# EAGLE design SigfoxTracker (EAGLE 9.6.2)
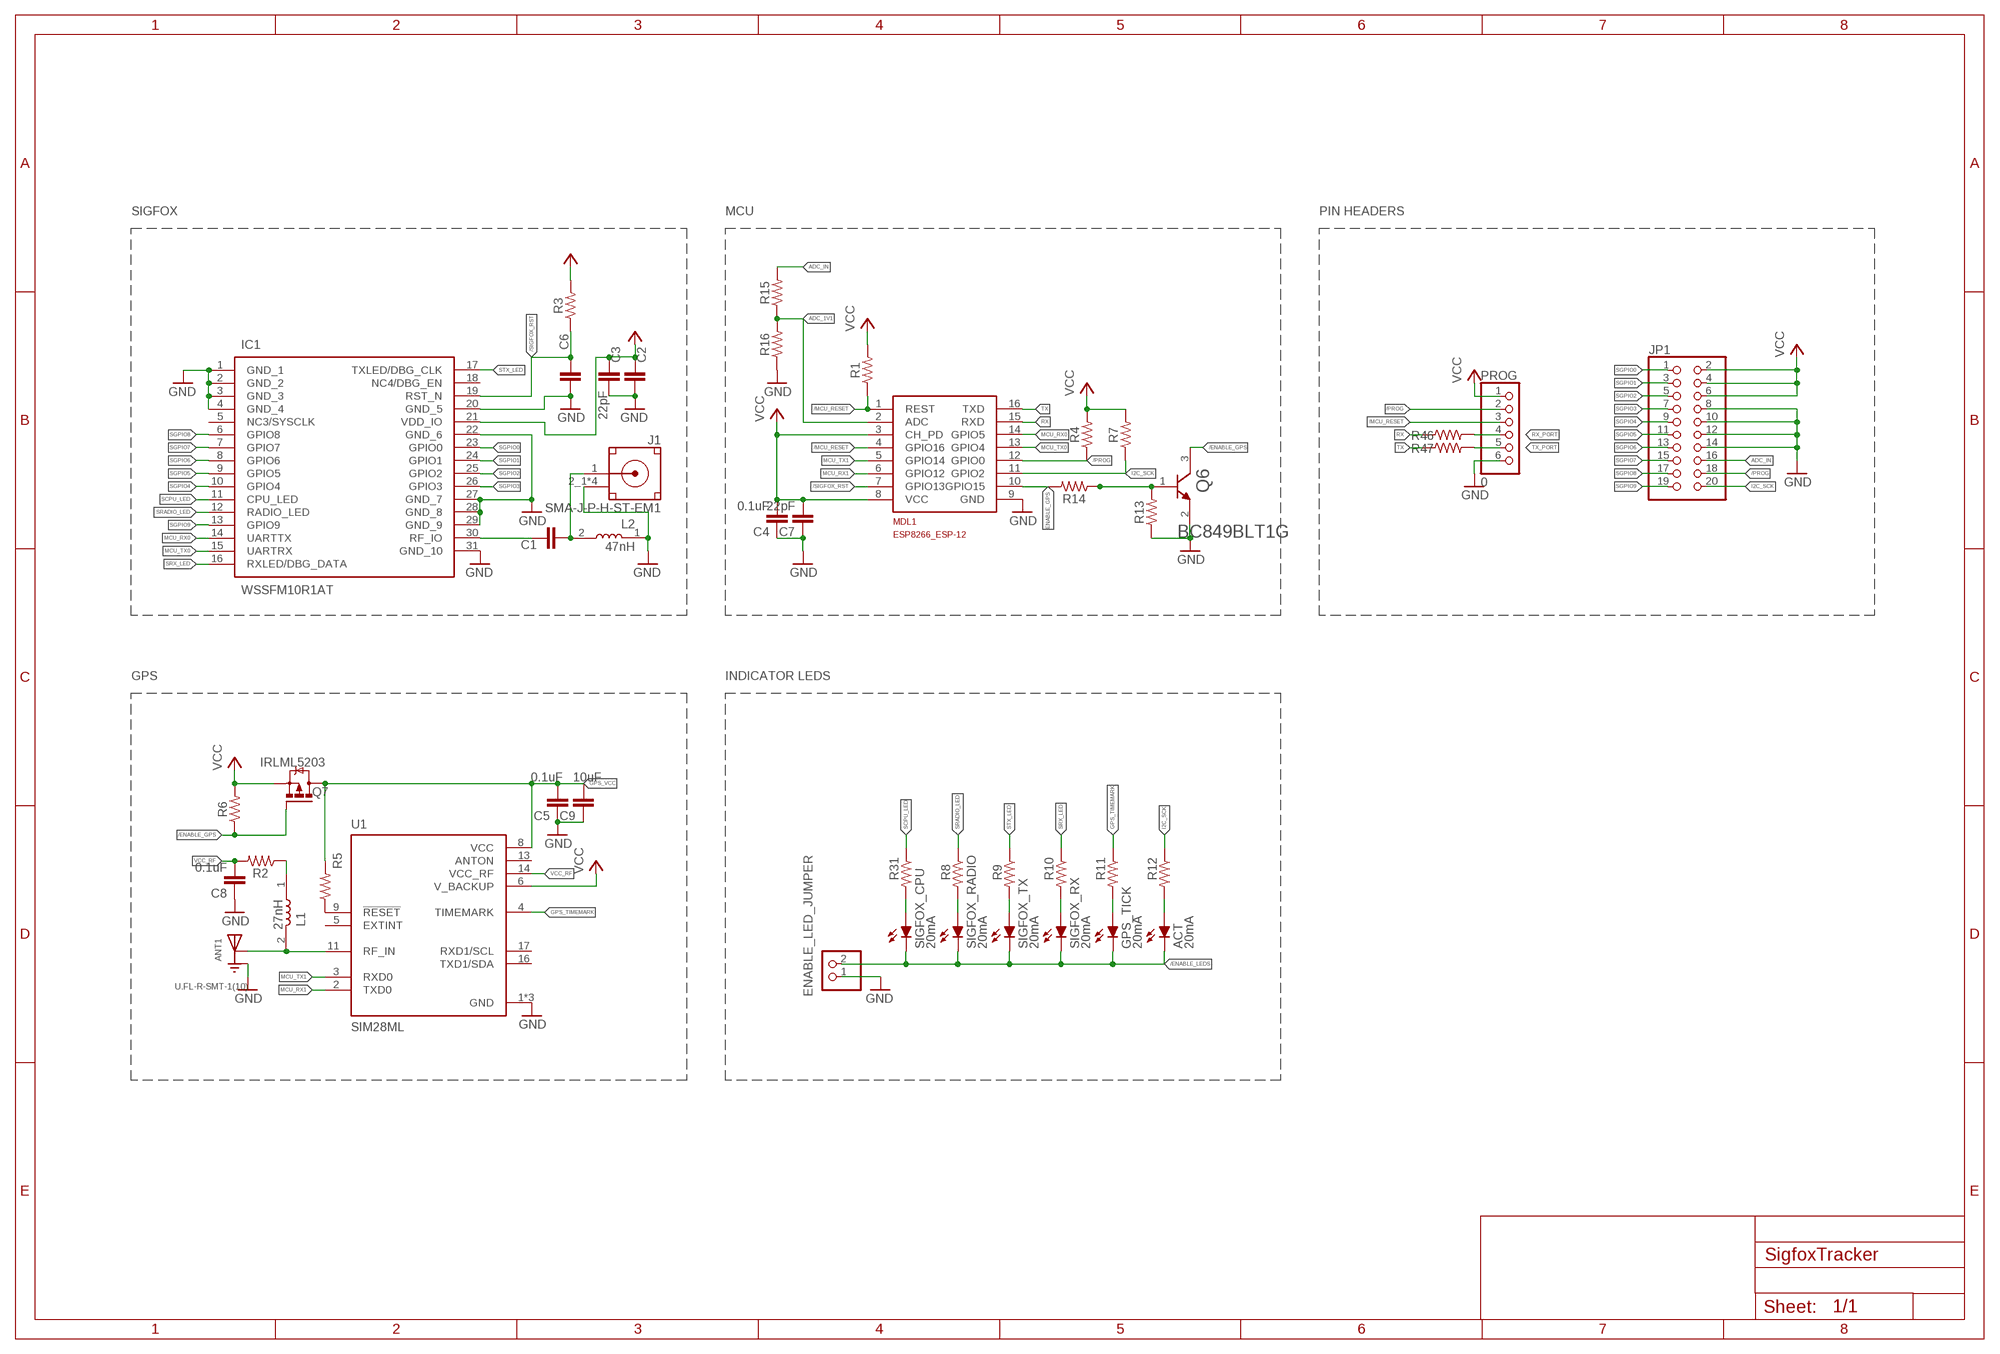
[diagram p0: schematic, sheet 1]

## Parts
ACT  20mA  LED_LEDCHIP-LED0603MP  [LED_CHIP-LED0603MP]
ANT1  U.FL-R-SMT-1(10)  [HRS_U.FL-R-SMT-1(10)]
C1  100pF  C-EUC0603  [C0603]
C2  0.1uF  C-EUC0603  [C0603]
C3  22pF  C-EUC0603  [C0603]
C4  0.1uF  C-EUC0603  [C0603]
C5  0.1uF  C-EUC0603  [C0603]
C6  0.1uF  C-EUC0603  [C0603]
C7  22pF  C-EUC0603  [C0603]
C8  0.1uF  C-EUC0603  [C0603]
C9  10uF  C-EUC0603  [C0603]
ENABLE_LED_JUMPER  PINHD-1X2  [1X02]
GPS_TICK  20mA  LED_LEDCHIP-LED0603MP  [LED_CHIP-LED0603MP]
IC1  WSSFM10R1AT  [WSSFM10R1AT]
J1  SMA-J-P-H-ST-EM1  [SMA-J-P-H-ST-EM1]
JP1  PINHD-2X10  [2X10]
L1  27nH  LQG15HN27NJ02D  [INDC1005X45]
L2  47nH  LQG15HN27NJ02D  [INDC1005X45]
MDL1  MCU  ESP8266-12GPIO04/05_CORRECTED  [ESP8266-ESP12]
PROG  0  PINHD-1X6  [1X06]
Q6  ON_SEMICONDUCTOR_BC849BLT1GON_SEMICONDUCTOR_BC849BLT1G_0_0  [ON_SEMICONDUCTOR_BC849BLT1G_0]
Q7  IRLML5203  [MICRO3]
R1  100k  52101-101-REV-A_RC-MASTER-SMD_R_0603MP  [52101-101-REV-A_RC-MASTER-SMD_R0603MP]
R2  10R  RC-MASTER-SMD_R_0603MP  [RC-MASTER-SMD_R0603MP]
R3  100K  RC-MASTER-SMD_R_0603MP  [RC-MASTER-SMD_R0603MP]
R4  4K7  52101-101-REV-A_RC-MASTER-SMD_R_0603MP  [52101-101-REV-A_RC-MASTER-SMD_R0603MP]
R5  100k  52101-101-REV-A_RC-MASTER-SMD_R_0603MP  [52101-101-REV-A_RC-MASTER-SMD_R0603MP]
R6  100K  RC-MASTER-SMD_R_0603MP  [RC-MASTER-SMD_R0603MP]
R7  4K7  52101-101-REV-A_RC-MASTER-SMD_R_0603MP  [52101-101-REV-A_RC-MASTER-SMD_R0603MP]
R8  1K  52101-101-REV-A_RC-MASTER-SMD_R_0603MP  [52101-101-REV-A_RC-MASTER-SMD_R0603MP]
R9  1K  52101-101-REV-A_RC-MASTER-SMD_R_0603MP  [52101-101-REV-A_RC-MASTER-SMD_R0603MP]
R10  1K  52101-101-REV-A_RC-MASTER-SMD_R_0603MP  [52101-101-REV-A_RC-MASTER-SMD_R0603MP]
R11  1K  52101-101-REV-A_RC-MASTER-SMD_R_0603MP  [52101-101-REV-A_RC-MASTER-SMD_R0603MP]
R12  1K  52101-101-REV-A_RC-MASTER-SMD_R_0603MP  [52101-101-REV-A_RC-MASTER-SMD_R0603MP]
R13  100k  52101-101-REV-A_RC-MASTER-SMD_R_0603MP  [52101-101-REV-A_RC-MASTER-SMD_R0603MP]
R14  1K  52101-101-REV-A_RC-MASTER-SMD_R_0603MP  [52101-101-REV-A_RC-MASTER-SMD_R0603MP]
R15  10K  52101-101-REV-A_RC-MASTER-SMD_R_0603MP  [52101-101-REV-A_RC-MASTER-SMD_R0603MP]
R16  3V3  52101-101-REV-A_RC-MASTER-SMD_R_0603MP  [52101-101-REV-A_RC-MASTER-SMD_R0603MP]
R31  1K  52101-101-REV-A_RC-MASTER-SMD_R_0603MP  [52101-101-REV-A_RC-MASTER-SMD_R0603MP]
R46  20R  RC-MASTER-SMD_R_0603MP  [RC-MASTER-SMD_R0603MP]
R47  20R  RC-MASTER-SMD_R_0603MP  [RC-MASTER-SMD_R0603MP]
SIGFOX_CPU  20mA  LED_LEDCHIP-LED0603MP  [LED_CHIP-LED0603MP]
SIGFOX_RADIO  20mA  LED_LEDCHIP-LED0603MP  [LED_CHIP-LED0603MP]
SIGFOX_RX  20mA  LED_LEDCHIP-LED0603MP  [LED_CHIP-LED0603MP]
SIGFOX_TX  20mA  LED_LEDCHIP-LED0603MP  [LED_CHIP-LED0603MP]
U1  SIM28ML  [XCVR_SIM28ML]

## Nets
/ENABLE_GPS: Q6.3(C) Q7.1(G) R6.1
/ENABLE_LEDS: ACT.C ENABLE_LED_JUMPER.2 GPS_TICK.C SIGFOX_CPU.C SIGFOX_RADIO.C SIGFOX_RX.C SIGFOX_TX.C
/MCU_RESET: MDL1.1(REST) MDL1.4(GPIO16) PROG.3 R1.1
/PROG: JP1.18 MDL1.12(GPIO0) PROG.2 R4.1
/SIGFOX_RST: C6.1 IC1.19(RST_N) MDL1.7(GPIO13) R3.1
ADC_1V1: MDL1.2(ADC) R15.1 R16.2
ADC_IN: JP1.16 R15.2
ENABLE_GPS: MDL1.10(GPIO15) R14.2
GND: ANT1.1(GND) ANT1.3(GND) C2.1 C3.1 C4.1 C5.1 C6.2 C7.1 C8.1 C9.1 ENABLE_LED_JUMPER.1 IC1.1(GND_1) IC1.2(GND_2) IC1.3(GND_3) IC1.4(GND_4) IC1.20(GND_5) IC1.22(GND_6) IC1.27(GND_7) IC1.28(GND_8) IC1.29(GND_9) IC1.31(GND_10) J1.2_1(GND) J1.2_2(GND) J1.3_1(GND) J1.3_2(GND) JP1.8 JP1.10 JP1.12 JP1.14 L2.1 MDL1.9(GND) PROG.6 Q6.2(E) R13.1 R16.1 U1.1(GND) U1.10(GND) U1.12(GND)
GPS_TIMEMARK: R11.1 U1.4(TIMEMARK)
GPS_VCC: C5.2 C9.2 Q7.3(D) R5.2 U1.8(VCC)
I2C_SCK: JP1.20 MDL1.11(GPIO2) R7.1 R12.1
MCU_RX0: IC1.14(UARTTX) MDL1.14(GPIO5)
MCU_RX1: MDL1.6(GPIO12) U1.2(TXD0)
MCU_TX0: IC1.15(UARTRX) MDL1.13(GPIO4)
MCU_TX1: MDL1.5(GPIO14) U1.3(RXD0)
N$1: R5.1 U1.9(!RESET)
N$2: C1.2 J1.1(SIGNAL) L2.2
N$3: L1.1 R2.1
N$4: R8.2 SIGFOX_RADIO.A
N$5: R9.2 SIGFOX_TX.A
N$6: R10.2 SIGFOX_RX.A
N$7: GPS_TICK.A R11.2
N$8: ACT.A R12.2
N$9: R31.2 SIGFOX_CPU.A
N$10: Q6.1(B) R13.2 R14.1
RF_IN: ANT1.2(SIG) L1.2 U1.11(RF_IN)
RX: MDL1.15(RXD) R46.1
RX_PORT: PROG.4 R46.2
SCPU_LED: IC1.11(CPU_LED) R31.1
SGPIO0: IC1.23(GPIO0) JP1.1
SGPIO1: IC1.24(GPIO1) JP1.3
SGPIO2: IC1.25(GPIO2) JP1.5
SGPIO3: IC1.26(GPIO3) JP1.7
SGPIO4: IC1.10(GPIO4) JP1.9
SGPIO5: IC1.9(GPIO5) JP1.11
SGPIO6: IC1.8(GPIO6) JP1.13
SGPIO7: IC1.7(GPIO7) JP1.15
SGPIO8: IC1.6(GPIO8) JP1.17
SGPIO9: IC1.13(GPIO9) JP1.19
SIGFOX_RF_IO: C1.1 IC1.30(RF_IO)
SRADIO_LED: IC1.12(RADIO_LED) R8.1
SRX_LED: IC1.16(RXLED/DBG_DATA) R10.1
STX_LED: IC1.17(TXLED/DBG_CLK) R9.1
TX: MDL1.16(TXD) R47.1
TX_PORT: PROG.5 R47.2
VCC: C2.2 C3.2 C4.2 C7.2 IC1.21(VDD_IO) JP1.2 JP1.4 JP1.6 MDL1.3(CH_PD) MDL1.8(VCC) PROG.1 Q7.2(S) R1.2 R3.2 R4.2 R6.2 R7.2 U1.6(V_BACKUP)
VCC_RF: C8.2 R2.2 U1.14(VCC_RF)
Unconnected: IC1.5(NC3/SYSCLK) IC1.18(NC4/DBG_EN) U1.5(EXTINT) U1.16(TXD1/SDA) U1.17(RXD1/SCL)

## Notes on the sheet
- SIGFOX | MCU | PIN HEADERS
- GPS | INDICATOR LEDS

## Power pins joined to a net without a drawn wire
ANTON: U1.13(ANTON)

## Library data of the parts
ACT GPS_TICK SIGFOX_CPU SIGFOX_RADIO SIGFOX_RX SIGFOX_TX = 52101-101-REV-A:LED_LED: LED Various Types
ANT1 = U.FL-R-SMT-1_10_:U.FL-R-SMT-1(10): U.FL Series 6 Ghz 50 Ohm Ultra-small SMT Coaxial Cable Receptacle; AVAILABILITY: Unavailable; DESCRIPTION: U.FL Series 6 Ghz 50 Ohm Ultra-small SMT Coaxial Cable Receptacle; MF: Hirose; MP: U.FL-R-SMT-1_10_; PACKAGE: None; PRICE: None
C1-C9 = rcl:C-EU: CAPACITOR, European symbol; SPICEPREFIX: C
ENABLE_LED_JUMPER = pinhead:PINHD-1X2: PIN HEADER
IC1 = WSSFM10R1AT:WSSFM10R1AT: SIGFOX MODULE RCZ1 AT VERSION Source: Datasheet <http://www.erikrasmussen.dk/wisol_wssfm10r1at.pdf>; ARROW_PART_NUMBER: WSSFM10R1AT; DESCRIPTION: SIGFOX MODULE RCZ1 AT VERSION; HEIGHT: 2mm; MANUFACTURER_NAME: Wisol; MANUFACTURER_PART_NUMBER: WSSFM10R1AT
J1 = SMA-J-P-H-ST-EM1:SMA-J-P-H-ST-EM1: Connector SMA F 50Ohm Solder ST Edge Mount Gold Over Nickel Tray; AVAILABILITY: Unavailable; DESCRIPTION: Connector SMA F 50Ohm Solder ST Edge Mount Gold Over Nickel Tray; MF: Samtec; MP: SMA-J-P-H-ST-EM1; PACKAGE: None; PRICE: None
JP1 = pinhead:PINHD-2X10: PIN HEADER
L1 L2 = LQG15HN27NJ02D:LQG15HN27NJ02D: Ind RF Chip Multi-Layer 27nH 5% 100MHz 8Q-Factor Air 300mA 0402 Paper T/R; AVAILABILITY: Unavailable; DESCRIPTION: Inductor RF Chip Multi-Layer 27nH 5% 100MHz 8Q-Factor Air 300mA 670mOhm DCR 0402 T/R; MF: Murata; MP: LQG15HN27NJ02D; PACKAGE: 0402 Murata; PRICE: None
MDL1 = ESP8266-ESP12:ESP8266-12: Espressif ESP8266 ESP-12 Module with GPIO04 and GPIO05 corrected.
PROG = pinhead:PINHD-1X6: PIN HEADER
Q6 = On Semiconductor - BC849BLT1G:ON_SEMICONDUCTOR_BC849BLT1G: ONSC-NPN-B1E2C3-3; CIIVA_IDS: 19369299; COMPONENT_LINK_1_DESCRIPTION: Manufacturer URL; COMPONENT_LINK_1_URL: http://www.onsemi.com/; COMPONENT_LINK_3_DESCRIPTION: Package Specification; COMPONENT_LINK_3_URL: http://www.onsemi.cn/pub_link/Collateral/318-08.PDF; DATASHEET: http://www.onsemi.cn/pub_link/Collateral/BC846ALT1-D.PDF; DATASHEET_VERSION: Rev. 11; FOOTPRINT_VARIANT_NAME_0: Manufacturer Recommended; FT_MIN_MHZ: 100; IC_CONTINUOUS_A: 0.1; IMPORTED: yes; IMPORTED_FROM: vault; IMPORT_TS: 1521843736; MF: On Semiconductor; MOUNTING_TECHNOLOGY: Surface Mount; MPN: BC849BLT1G; PACKAGE: SOT-23-3-318-08; PACKAGE_DESCRIPTION: 3-Pin Small Outline Transistor, Body 2.92 x 1.3 mm, Pitch 0.95 mm; PACKAGE_VERSION: Rev. AP, 11/2009; PACKING: Tape and Reel; POLARITY: NPN; PREFIX: Q; RELEASE_DATE: 1406898388; ROHS: Yes; VAULT_GUID: 19D3C7D6-08FD-4A81-9BD4-62C7617130FB; VAULT_REVISION: B4675A61-FAF7-4072-9C56-0A9635A35669
Q7 = transistor-power:IRLML5203: HEXFET P-Channel Power MOSFET
R1 R4 R5 R7-R16 R31 = ESP32_DMX_Audio:52101-101-REV-A_RC-MASTER-SMD_R_: RESISTOR
R2 R3 R6 R46 R47 = 52101-101-REV-A:RC-MASTER-SMD_R_: RESISTOR
U1 = SIM28ML:SIM28ML: Module: GPS; ±2.5m; ±0, 1m/s; GPIO, PPS, UART; -165dBm; 2.8÷4.3VDC; AVAILABILITY: Unavailable; DESCRIPTION: Module: GPS; ±2.5m; ±0, 1m/s; GPIO, PPS, UART; -165dBm; 2.8÷4.3VDC; MF: Simcom; MP: SIM28ML; PACKAGE: None; PRICE: None

## Board
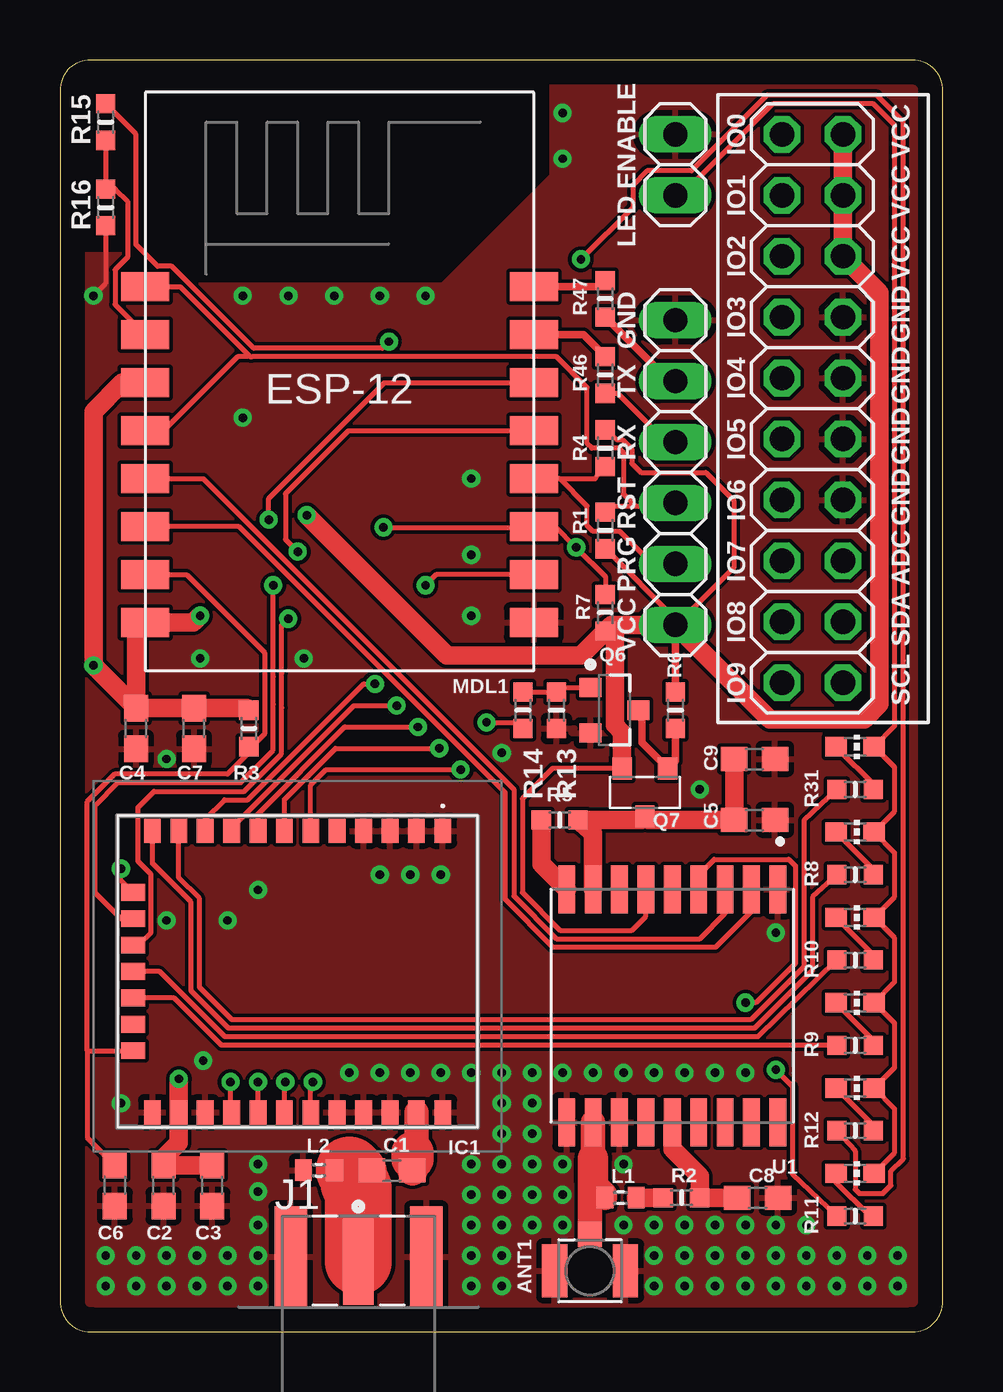
[diagram p1: board, top side]
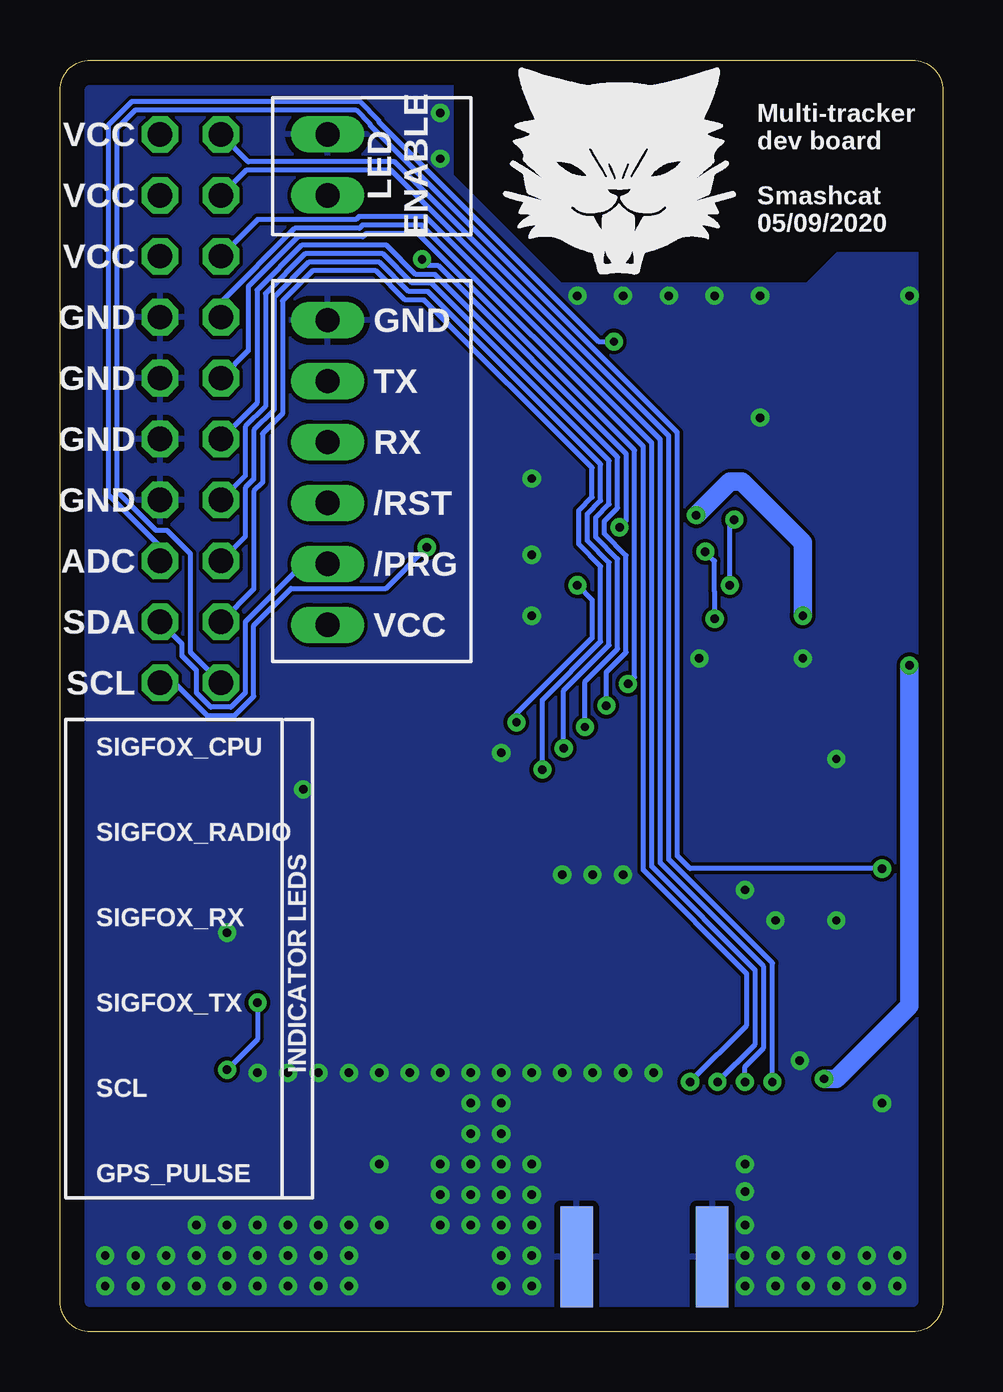
[diagram p2: board, bottom side, seen from below]

Size 36.81 x 53.01 mm. Coordinates in mm from the lower left corner, seen from the top.
Outline: 0,51.74 0,1.27 arc90 1.27,0 35.54,0 arc90 36.81,1.27 36.81,51.74 arc90 35.54,53.01 1.27,53.01 arc90 0,51.74
Copper layers (1*16): Top 0.035mm / dielectric 1.5mm / Bottom 0.035mm
Design rules "default": minimum track width 6mil, minimum drill 0.35mm, track to track 6mil, track to pad 6mil, pad to pad 6mil, via to via 6mil, smd to smd 6mil, copper to edge 40mil, drill to drill 6mil, minimum pad ring 10mil, minimum via ring 8mil, stop-mask expansion 4mil, vias tented up to drill 0mil, thermal gap 10mil

### Footprints (pad centres in the part's own frame; a part is rotated, then mirrored left to right if it is on the bottom)
LED_CHIP-LED0603MP = smd 0.8 x 0.9: A 0,-0.794; C 0,0.794
HRS_U.FL-R-SMT-1(10) = smd 1.05 x 2.2: 1 -1.475,0; 3 1.475,0 | smd 1 x 1.05: 2 0,-1.525
C0603 = smd 1.1 x 1: 1 -0.85,0; 2 0.85,0
1X02 = drill 1.016 long: 1 -1.27,0; 2 1.27,0
WSSFM10R1AT = smd 1 x 0.7: 1 -5.635,6.05; 2 -5.635,4.95; 3 -5.635,3.85; 4 -5.635,2.75; 5 -5.635,1.65; 6 -5.635,0.55; 7 -5.635,-0.55; 8 -5.635,-1.65; 9 -5.635,-2.75; 10 -5.635,-3.85; 11 -5.635,-4.95; 12 -5.635,-6.05; 20 6.085,-6.05; 21 6.085,-4.95; 22 6.085,-3.85; 23 6.085,-2.75; 24 6.085,-1.65; 25 6.085,-0.55; 26 6.085,0.55; 27 6.085,1.65; 28 6.085,2.75; 29 6.085,3.85; 30 6.085,4.95; 31 6.085,6.05 | smd 0.7 x 1: 13 -3.075,-6.86; 14 -1.975,-6.86; 15 -0.875,-6.86; 16 0.225,-6.86; 17 1.325,-6.86; 18 2.425,-6.86; 19 3.525,-6.86
SMA-J-P-H-ST-EM1 = smd 1.27 x 3.6: 1 0,0 | smd 1.35 x 4.2: 2_1 -2.825,0.2; 3_1 2.825,0.2 | smd 1.35 x 4.2 bottom: 2_2 -2.825,0.2; 3_2 2.825,0.2
2X10 = drill 1.016 octagon: 1 -11.43,-1.27; 2 -11.43,1.27; 3 -8.89,-1.27; 4 -8.89,1.27; 5 -6.35,-1.27; 6 -6.35,1.27; 7 -3.81,-1.27; 8 -3.81,1.27; 9 -1.27,-1.27; 10 -1.27,1.27; 11 1.27,-1.27; 12 1.27,1.27; 13 3.81,-1.27; 14 3.81,1.27; 15 6.35,-1.27; 16 6.35,1.27; 17 8.89,-1.27; 18 8.89,1.27; 19 11.43,-1.27; 20 11.43,1.27
INDC1005X45 = smd 0.7 x 0.9: 1 -0.65,0; 2 0.65,0
ESP8266-ESP12 = smd 2 x 1.2: 1 0,16; 2 0,14; 3 0,12; 4 0,10; 5 0,8; 6 0,6; 7 0,4; 8 0,2; 9 16.2,2; 10 16.2,4; 11 16.2,6; 12 16.2,8; 13 16.2,10; 14 16.2,12; 15 16.2,14; 16 16.2,16
1X06 = drill 1.016 long: 1 -6.35,0; 2 -3.81,0; 3 -1.27,0; 4 1.27,0; 5 3.81,0; 6 6.35,0
ON_SEMICONDUCTOR_BC849BLT1G_0 = smd 0.9 x 0.8: 1 -1,0.95; 2 -1,-0.95; 3 1,0
MICRO3 = smd 0.8 x 0.9: 1 -0.95,-1; 2 0.95,-1; 3 0,1
52101-101-REV-A_RC-MASTER-SMD_R0603MP = smd 0.8 x 0.8: 1 -0.762,0; 2 0.762,0
RC-MASTER-SMD_R0603MP = smd 0.8 x 0.8: 1 -0.762,0; 2 0.762,0
XCVR_SIM28ML = smd 2 x 0.7: 1 -4.85,4.4; 2 -4.85,3.3; 3 -4.85,2.2; 4 -4.85,1.1; 5 -4.85,0; 6 -4.85,-1.1; 7 -4.85,-2.2; 8 -4.85,-3.3; 9 -4.85,-4.4; 10 4.85,-4.4; 11 4.85,-3.3; 12 4.85,-2.2; 13 4.85,-1.1; 14 4.85,0; 15 4.85,1.1; 16 4.85,2.2; 17 4.85,3.3; 18 4.85,4.4

### Placement (x,y rotation side)
ACT  33.15,10.16 270 top
ANT1  22.1,2.54 180 top
C1  13.84,6.73 180 top
C2  4.32,6.1 90 top
C3  6.35,6.1 90 top
C4  3.17,25.15 90 top
C5  28.96,21.34 180 top
C6  2.29,6.1 270 top
C7  5.59,25.15 90 top
C8  29.08,5.59 180 top
C9  28.96,23.88 180 top
ENABLE_LED_JUMPER  25.65,48.64 270 top
GPS_TICK  33.15,6.6 270 top
IC1  9.91,15.24 270 top
J1  12.45,2.92 0 top
JP1  31.37,38.48 270 top
L1  23.37,5.59 180 top
L2  10.79,6.73 0 top
MDL1  3.56,27.56 0 top
PROG  25.65,35.81 90 top
Q6  23.11,25.91 0 top
Q7  24.38,22.48 180 top
R1  22.73,33.4 270 top
R2  25.91,5.59 0 top
R3  7.87,25.15 90 top
R4  22.73,36.83 90 top
R5  20.83,21.34 0 top
R6  25.65,25.91 90 top
R7  22.73,29.97 270 top
R8  33.15,19.05 0 top
R9  33.15,11.94 0 top
R10  33.15,15.49 0 top
R11  33.15,4.83 0 top
R12  33.15,8.38 0 top
R13  20.7,25.91 90 top
R14  19.3,25.91 270 top
R15  1.91,50.42 90 top
R16  1.91,46.86 90 top
R31  33.15,22.61 0 top
R46  22.73,39.88 270 top
R47  22.73,43.05 270 top
SIGFOX_CPU  33.15,24.38 270 top
SIGFOX_RADIO  33.15,20.83 270 top
SIGFOX_RX  33.15,17.27 270 top
SIGFOX_TX  33.15,13.72 270 top
U1  25.53,13.59 270 top

### Tracks (layer width: path | path; a pad name or v marks a point on that pad's centre or on a via)
/ENABLE_GPS
  Top 0.305: Q6.3 24.26,25.77 24.26,24.56 Q7.1 25.65,23.8 R6.1
/ENABLE_LEDS
  Top 0.203: ENABLE_LED_JUMPER.2 25.91,47.37 29.72,51.18 33.91,51.18 34.8,50.29 34.8,25.24 SIGFOX_CPU.C 34.8,23.52 34.8,21.69 SIGFOX_RADIO.C 34.8,19.97 34.8,18.13 SIGFOX_RX.C 34.8,16.41 34.8,14.58 SIGFOX_TX.C 34.8,12.86 34.8,11.02 ACT.C 34.8,9.3 34.8,7.46 GPS_TICK.C
/MCU_RESET
  Top 0.203: R1.1 22.88,34.4 24,34.4 | 7.93,40.64 7.4,40.64 4.32,37.56 MDL1.4 | PROG.3 25.51,34.4 24,34.4 | 24,34.4 23.49,34.91 23.49,36.63 23.29,36.83 22.17,36.83 21.98,37.02 21.98,39.36 20.7,40.64 8,40.64 7.93,40.64 | MDL1.1 5.01,43.56 7.93,40.64
/PROG
  Top 0.203: PROG.2 24.69,32 23.34,33.35 22.22,33.35 21.98,33.6 21.98,34.42 20.84,35.56 MDL1.12 22.31,35.56 R4.1
  Bottom 0.203: PROG.2 26.67,32 29.08,29.59 29.08,26.63 29.68,26.04 30.52,26.04 31.11,26.63 31.11,27.56 31.73,28.17 31.73,28.68 JP1.18
/SIGFOX_RST
  Top 0.203: R3.1 7.87,24.26 | 7.87,24.26 7.87,24.13 6.99,23.24 2.29,23.24 1.12,22.07 1.12,11.74 1.14,11.71 | 1.14,11.71 IC1.19 | MDL1.7 5.27,31.56 8.53,28.3 8.53,24.91 7.87,24.26 | 1.14,11.71 1.14,8.09 C6.1
ADC_1V1
  Top 0.203: R15.1 R16.2 2.31,47.62 2.82,47.12 2.82,44.78 2.3,44.26 2.3,42.81 MDL1.2
ADC_IN  (via drill 0.35)
  Top 0.203: v13.72,41.27 13.44,41 8.08,41 4.66,44.41 4.06,44.41 3.17,45.3 3.17,49.91 R15.2
  Bottom 0.203: JP1.16 32.64,32.73 34.77,34.87 34.77,50.31 33.8,51.28 24.32,51.28 23.52,50.48 23.52,50.43 14.36,41.27 v13.72,41.27
ENABLE_GPS  (via drill 0.35)
  Top 0.203: MDL1.10 15.68,31.56 v15.24,31.11 | v17.78,25.4 19.05,25.4 R14.2
  Bottom 0.203: v15.24,31.11 14.63,30.5 14.63,28.91 17.78,25.76 v17.78,25.4
GND  (via drill 0.35)
  Top 0.203: R16.1 1.91,43.69 v1.39,43.18
  other vias: 20.95,10.79 23.5,10.79 4.45,23.88 2.54,9.53 29.84,16.64 5.97,11.3 15.88,19.05 10.16,28.07 5.84,28.07 17.14,29.84 7.62,43.18 9.53,43.18 11.43,43.18 13.34,43.18 15.24,43.18 7.62,38.1 17.14,35.56 14.61,19.05 13.34,19.05 15.88,10.79 14.61,10.79 13.34,10.79 12.06,10.79 5.71,3.17 5.71,1.91 4.45,1.91 6.99,1.91 18.41,1.91 26.04,1.91 27.3,1.91 28.57,1.91 29.84,1.91 33.66,1.91 34.92,1.91 34.92,3.17 20.95,48.9 20.95,50.8 17.14,32.38 8.26,1.91 26.67,22.61 4.45,17.14 6.99,17.14 8.26,18.41 18.41,9.53 19.68,9.53 18.41,8.26 19.68,8.26 17.14,5.71 18.41,5.71 19.68,5.71 17.14,3.17 18.41,3.17 17.14,1.91 8.26,6.99 8.26,5.84 4.45,3.17 6.99,3.17 8.26,3.17 33.66,3.17 29.84,3.17 28.57,3.17 27.3,3.17 26.04,3.17 17.14,10.79 18.41,10.79 19.68,10.79 22.23,10.79 28.57,10.79 27.3,10.79 26.04,10.79 24.77,10.79 20.95,5.71 17.14,4.45 18.41,4.45 20.95,6.99 19.68,6.99 18.41,6.99 17.14,6.99 19.68,4.45 20.95,4.45 26.04,4.45 27.3,4.45 28.57,4.45 29.84,4.45 23.5,4.45 23.5,6.99 24.77,4.45 32.38,1.91 31.11,1.91 31.11,3.17 32.38,3.17 31.11,4.45 1.91,3.17 3.17,3.17 1.91,1.91 3.17,1.91 8.26,4.45 24.77,3.17 24.77,1.91 18.41,24.13
  pour Top: -2.54,57.15 39.37,57.15 39.37,-2.54 -2.54,-2.54
  pour Bottom: -2.54,57.15 39.37,57.15 39.37,-2.54 -2.54,-2.54
  cutout Bottom: -3.17,58.42 20.32,58.42 20.32,48.26 15.88,43.81 5.71,43.81 4.45,45.09 -2.54,45.09 -3.17,45.72
  cutout Top: -3.17,58.42 20.32,58.42 20.32,48.26 15.88,43.81 5.71,43.81 4.45,45.09 -3.17,45.09
GPS_TIMEMARK  (via drill 0.35)
  Top 0.203: U1.4 26.63,19.05 27.27,19.69 30.38,19.69 30.66,19.42 30.66,15.36 29.01,13.72 v28.57,13.72 | R11.1 30.53,6.59 30.53,10.24 v29.84,10.92
  Bottom 0.203: v28.57,13.72 28.57,12.19 v29.84,10.92
GPS_VCC
  Top 0.762: C9.2 C5.2 24.53,21.34 Q7.3 24.24,21.34 R5.2 22.23,20.79 U1.8
I2C_SCK  (via drill 0.35)
  Top 0.203: R12.1 33.15,7.53 33.15,5.93 33.32,5.76 34.31,5.76 34.65,6.1 34.65,6.71 35.16,7.22 35.16,27.96 35.15,27.96 35.15,50.44 34.06,51.54 29.48,51.54 26.33,48.39 24.47,48.39 23.88,47.79 23.88,46.86 v21.72,44.7 | R7.1 22.73,31.48 v21.52,32.69 20.65,33.56 MDL1.11 19.73,33.53 v13.48,33.53
  Bottom 0.203: v21.72,44.7 21.46,44.45 21.06,44.45 13.21,36.6 13.21,33.8 v13.48,33.53 | JP1.20 32.04,27.05 30.67,25.68 29.53,25.68 28.73,26.48 28.73,29.44 27.18,30.99 23.23,30.99 v21.52,32.69
MCU_RX0  (via drill 0.35)
  Top 0.203: IC1.14 2.55,17.21 1.47,18.29 1.47,21.93 2.43,22.89 7.54,22.89 8.88,24.23 8.88,26.16 8.89,26.16 8.89,27.3 8.88,27.31 v8.88,31.11 v8.89,31.11 | v8.7,33.85 8.7,34.74 13.52,39.56 MDL1.14
  Bottom 0.203: v8.89,31.11 8.89,33.66 v8.7,33.85
MCU_RX1
  Top 0.203: U1.2 28.83,17.53 27.32,16.03 20.55,16.03 18.57,18.01 18.57,22.46 7.47,33.56 MDL1.6
MCU_TX0  (via drill 0.35)
  Top 0.203: IC1.15 3.28,16.11 3.8,16.63 3.8,19.07 3.25,19.61 3.25,21.86 3.92,22.53 7.68,22.53 9.24,24.09 9.24,26.01 9.25,26.02 9.25,27.45 9.24,27.46 9.24,29.44 v9.52,29.72 | v9.91,32.52 9.4,33.02 9.4,34.93 12.03,37.56 MDL1.13
  Bottom 0.203: v9.52,29.72 9.52,30.85 9.52,32.13 v9.91,32.52
MCU_TX1
  Top 0.203: MDL1.5 5.97,35.56 18.92,22.61 18.92,18.16 20.7,16.38 26.67,16.38 27.73,17.44 U1.3
N$1
  Top 0.762: R5.1 20.07,19.5 U1.9
N$2
  Top 1.016: L2.2 12.06,6.73 C1.2
  Top 2.54: 12.06,6.73 12.38,6.41 12.38,6.24 12.45,6.18
  Top 2.794: J1.1 12.45,6 12.26,6.19 12.26,6.54 12.06,6.73
N$3
  Top 0.762: L1.1 R2.1
N$4
  Top 0.203: SIGFOX_RADIO.A 34,19.18 R8.2
N$5
  Top 0.203: SIGFOX_TX.A 34,12.07 R9.2
N$6
  Top 0.203: SIGFOX_RX.A 34,15.63 R10.2
N$7
  Top 0.203: GPS_TICK.A 32.35,6.22 33.75,4.83 R11.2
N$8
  Top 0.203: ACT.A 34,8.52 R12.2
N$9
  Top 0.203: SIGFOX_CPU.A 34,22.74 R31.2
N$10
  Top 0.203: R14.1 R13.2 20.89,26.86 Q6.1
RF_IN
  Top 1.016: U1.11 22.23,7.24 | L1.2 22.72,5.73 22.23,6.22 22.1,6.1 ANT1.2
  Top 1.27: 22.23,6.22 22.23,7.24
RX
  Top 0.305: MDL1.15 21.81,41.56 R46.1
RX_PORT
  Top 0.203: R46.2 23.24,39.12 25.27,37.08 PROG.4
SCPU_LED
  Top 0.203: R31.1 31.01,21.32 31.01,15.22 28.8,13.01 7.17,13.01 5.82,14.36 5.82,18.05 4.96,18.91 IC1.11
SGPIO0  (via drill 0.35)
  Top 0.203: IC1.23 7.11,9.2 v7.11,10.41
  Bottom 0.203: v7.11,10.41 7.11,15.37 11.43,19.68 11.43,37.34 22.86,48.77 28.96,48.77 JP1.1
SGPIO1  (via drill 0.35)
  Top 0.203: IC1.24 v8.26,10.41
  Bottom 0.203: v8.26,10.41 8.26,11.05 7.47,11.84 7.47,15.22 11.79,19.54 11.79,37.19 23.01,48.41 29.06,48.41 JP1.3
SGPIO2  (via drill 0.35)
  Top 0.203: IC1.25 9.36,10.37 v9.4,10.41
  Bottom 0.203: v9.4,10.41 7.82,11.99 7.82,15.07 12.14,19.39 12.14,37.04 21.58,46.48 24.34,46.48 24.47,46.35 28.57,46.35 JP1.5
SGPIO3  (via drill 0.35)
  Top 0.203: IC1.26 10.46,10.33 v10.54,10.41
  Bottom 0.203: v10.54,10.41 8.18,12.78 8.18,14.93 12.5,19.24 12.5,36.9 21.73,46.13 24.2,46.13 24.32,46 27.03,46 30.1,42.93 JP1.7
SGPIO4  (via drill 0.35)
  Top 0.203: IC1.10 6.06,21.37 6.86,22.17 7.83,22.17 12.66,27 v13.13,27
  Bottom 0.203: v13.13,27 12.85,27.28 12.85,36.75 21.87,45.77 24.05,45.77 24.18,45.64 26.88,45.64 28.96,43.57 28.96,40.89 JP1.9
SGPIO5  (via drill 0.35)
  Top 0.203: IC1.9 7.16,21 12.26,26.1 v14.03,26.1
  Bottom 0.203: v14.03,26.1 14.03,27.5 13.21,28.32 13.21,32.36 14.12,33.27 14.12,33.79 13.56,34.34 13.56,36.45 21.18,44.07 21.98,44.07 23.2,45.29 26.73,45.29 28.6,43.42 28.6,38.71 JP1.11
SGPIO6  (via drill 0.35)
  Top 0.203: IC1.8 8.26,21.59 11.88,25.21 v14.92,25.21
  Bottom 0.203: v14.92,25.21 14.92,27.11 13.56,28.47 13.56,32.21 14.47,33.12 14.47,33.94 13.92,34.49 13.92,36.31 21.33,43.72 22.13,43.72 23.34,44.93 26.58,44.93 28.25,43.27 28.25,38.56 29.08,37.72 29.08,35.69 JP1.13
SGPIO7  (via drill 0.35)
  Top 0.203: IC1.7 9.36,22.19 11.49,24.32 v15.81,24.32
  Bottom 0.203: v15.81,24.32 15.81,26.72 13.92,28.62 13.92,32.06 14.83,32.97 14.83,34.08 14.28,34.64 14.28,36.16 21.48,43.36 22.27,43.36 23.49,44.58 26.44,44.58 27.89,43.12 27.89,38.41 28.73,37.58 28.73,35.54 29.09,35.18 29.09,35.09 29.08,35.09 29.08,33.15 JP1.15
SGPIO8  (via drill 0.35)
  Top 0.203: IC1.6 10.46,22.79 11.1,23.43 v16.7,23.43
  Bottom 0.203: v16.7,23.43 16.7,26.34 14.28,28.76 14.28,31.91 15.18,32.82 15.18,34.23 14.63,34.78 14.63,36.01 21.62,43.01 22.42,43.01 23.64,44.22 26.29,44.22 27.53,42.98 27.53,38.27 28.37,37.43 28.37,35.39 28.73,35.04 28.73,30.96 JP1.17
SGPIO9  (via drill 0.35)
  Top 0.203: IC1.13 2.54,18.82 v2.54,19.3
  Bottom 0.203: v2.54,19.3 10.55,19.3 11.07,19.83 11.07,37.48 23.88,50.29 23.88,50.33 24.47,50.93 33.66,50.93 34.42,50.16 34.42,35.01 32.81,33.4 32.34,33.4 31.37,32.42 31.37,28.32 JP1.19
SIGFOX_RF_IO
  Top 1.016: IC1.30 14.86,7.62
  Top 1.27: C1.1 14.69,7.2 | 14.86,7.62 14.69,7.45
  Top 1.778: 14.69,7.2 14.69,7.45
SRADIO_LED
  Top 0.203: R8.1 31.37,18.12 31.37,15.07 28.95,12.65 7.03,12.65 5.46,14.21 5.46,17.91 3.86,19.51 IC1.12
SRX_LED
  Top 0.203: R10.1 29.1,12.29 6.88,12.29 4.16,15.02 IC1.16
STX_LED
  Top 0.203: R9.1 6.73,11.94 4.75,13.91 IC1.17
TX
  Top 0.305: MDL1.16 22.48,43.56 R47.1
TX_PORT
  Top 0.305: R47.2 25.4,39.62 PROG.5
VCC  (via drill 0.35)
  Top 0.203: R4.2 23.23,37.19 23.44,37.19 23.84,36.78 23.84,36.2 24.22,35.81 26.92,35.81 28.09,34.65 28.09,31.85 25.68,29.44 | R1.2 25.68,29.69 25.68,29.49 PROG.1 | Q7.2 20.53,23.48 19.28,22.23 19.28,18.31 20.85,16.74 23.85,16.74 24.43,17.32 U1.6
  Top 0.305: R6.2 PROG.1
  Top 0.762: C4.2 C7.2 7.79,26 R3.2 | C4.2 3.17,29.18 MDL1.8 5.56,29.56 v5.84,29.84 | C4.2 v1.4,27.77 1.4,38.35 2.6,39.56 MDL1.3 | C3.2 C2.2 4.32,7.25 4.96,7.88 IC1.21 v4.95,10.54 | v10.29,34.04 16.13,28.19 21.72,28.19 R7.2 22.99,29.46 | Q7.2 23.43,24.98 23.13,25.29 23.13,29.32 22.99,29.46 | 22.99,29.46 PROG.1 | JP1.2 JP1.4 JP1.6 34.16,43.31 34.16,26.16 33.53,25.53 29.59,25.53 25.68,29.44 25.68,29.69
  Bottom 0.762: v4.95,10.54 4.45,10.54 1.4,13.59 v1.4,27.77 | v10.29,34.04 8.89,35.43 8.38,35.43 5.84,32.89 v5.84,29.84
VCC_RF
  Top 0.762: C8.2 R2.2 26.67,6.48 25.53,7.62 U1.14

### Text on the board
tPlace: IO0 | VCC | LED ENABLE | IO1 | VCC | IO2 | VCC | GND | IO3 | GND | TX | IO4 | GND | RX | IO5 | GND | RST | IO6 | GND | PRG | IO7 | ADC | IO8 | SDA | VCC | IO9 | SCL
bPlace: VCC | LED / ENABLE | VCC | Multi-tracker / dev board / / Smashcat / 05/09/2020 | VCC | GND | GND | TX | GND | RX | GND | /RST | GND | /PRG | ADC | SDA | VCC | SCL | SIGFOX_CPU | SIGFOX_RADIO | INDICATOR LEDS | SIGFOX_RX | SIGFOX_TX | SCL | GPS_PULSE